# EAGLE schematic the staff (EAGLE 7.1.0)
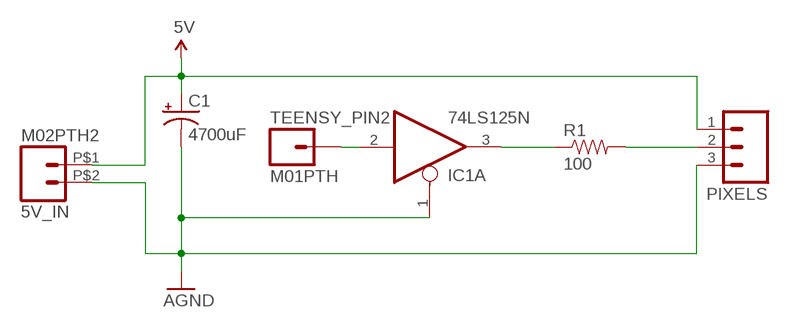
[diagram p0: schematic, sheet 1]

## Parts
5V_IN  M02PTH2  [1X02_BIG]
C1  4700uF  CAP_POLPTH3  [CPOL-RADIAL-1000UF-63V]
IC1  74LS125N  [DIL14]
PIXELS  M03JST-PTH  [JST-3-PTH]
R1  100  RESISTORPTH-1/4W  [AXIAL-0.4]
TEENSY_PIN2  M01PTH  [1X01]

## Nets
5V: 5V_IN.P$1 C1.1(+) PIXELS.1
AGND: 5V_IN.P$2 C1.2(-) IC1.1(A:OE) PIXELS.3
N$1: IC1.3(A:O) R1.P$1
N$2: PIXELS.2 R1.P$2
N$3: IC1.2(A:I) TEENSY_PIN2.1
Unconnected: IC1.4(B:OE) IC1.5(B:I) IC1.6(B:O) IC1.8(C:O) IC1.9(C:I) IC1.10(C:OE) IC1.11(D:O) IC1.12(D:I) IC1.13(D:OE)

## Power pins joined to a net without a drawn wire
GND: IC1.7(P:GND)
VCC: IC1.14(P:VCC)

## Library data of the parts
5V_IN = SparkFun-Connectors:M02: Standard 2-pin 0.1" header. Use with - straight break away headers ( PRT-00116) - right angle break away headers (PRT-00553) - swiss pins (PRT-00743) - machine pins (PRT-00117) - female headers (PRT-00115) Molex polarized connector foot print use with: PRT-08233 with associated crimp pins and housings. 2.54_SCREWTERM for use with PRT-10571. 3.5mm Screw Terminal footprints for PRT-08084 5mm Screw Terminal footprints for use with PRT-08433
C1 = SparkFun-Passives:CAP_POL: Capacitor Polarized These are standard SMD and PTH capacitors. Normally 10uF, 47uF, and 100uF in electrolytic and tantalum varieties. Always verify the external diameter of the through hole cap, it varies with capacity, voltage, and manufacturer. The EIA devices should be standard.
IC1 = adafruit:74*125: Quad bus BUFFER, 3-state
PIXELS = SparkFun-Connectors:M03: Header 3 Standard 3-pin 0.1" header. Use with straight break away headers (SKU : PRT-00116), right angle break away headers (PRT-00553), swiss pins (PRT-00743), machine pins (PRT-00117), and female headers (PRT-00115). Molex polarized connector foot print use with SKU : PRT-08232 with associated crimp pins and housings.; SKU: PRT-09915
R1 = SparkFun-Passives:RESISTOR: Resistor Basic schematic elements and footprints for 0603, 1206, and PTH resistors.
TEENSY_PIN2 = SparkFun-Connectors:M01: Header 1 Standard 1-pin 0.1" header. Use with straight break away headers (SKU : PRT-00116), right angle break away headers (PRT-00553), swiss pins (PRT-00743), machine pins (PRT-00117), and female headers (PRT-00115).